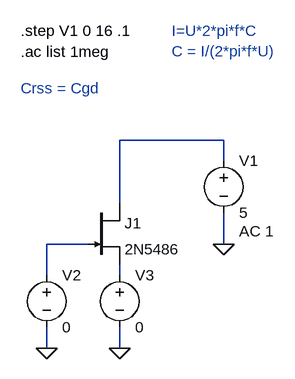
[diagram p0: schematic JFET_2N5486_Cgd.asc]
JFET_2N5486_Cgd.asc, the LTspice schematic file:
Version 4
SHEET 1 880 680
WIRE 416 16 256 16
WIRE 416 48 416 16
WIRE 256 112 256 16
WIRE 208 176 144 176
WIRE 416 176 416 128
WIRE 144 224 144 176
WIRE 256 224 256 208
WIRE 144 336 144 304
WIRE 256 336 256 304
FLAG 256 336 0
FLAG 144 336 0
FLAG 416 176 0
SYMBOL njf 208 112 R0
SYMATTR InstName J1
SYMATTR Value 2N5486
SYMBOL voltage 416 32 R0
WINDOW 123 24 124 Left 2
WINDOW 39 0 0 Left 2
SYMATTR InstName V1
SYMATTR Value 5
SYMATTR Value2 AC 1
SYMBOL voltage 144 208 R0
SYMATTR InstName V2
SYMATTR Value 0
SYMBOL voltage 256 208 R0
SYMATTR InstName V3
SYMATTR Value 0
TEXT 104 -120 Left 2 !.ac list 1meg
TEXT 104 -152 Left 2 !.step V1 0 16 .1
TEXT 336 -152 Left 2 ;I=U*2*pi*f*C\nC = I/(2*pi*f*U)
TEXT 104 -64 Left 2 ;Crss = Cgd

The netlist it stands for:
* JFET_2N5486_Cgd.asc
J1 N001 N002 N003 2N5486
V1 N001 0 5 AC 1
V2 N002 0 0
V3 N003 0 0
.model NJF NJF
.model PJF PJF
.lib standard.jft
.ac list 1meg
.step V1 0 16 .1
* I=U*2*pi*f*C
* C = I/(2*pi*f*U)
* Crss = Cgd
.backanno
.end